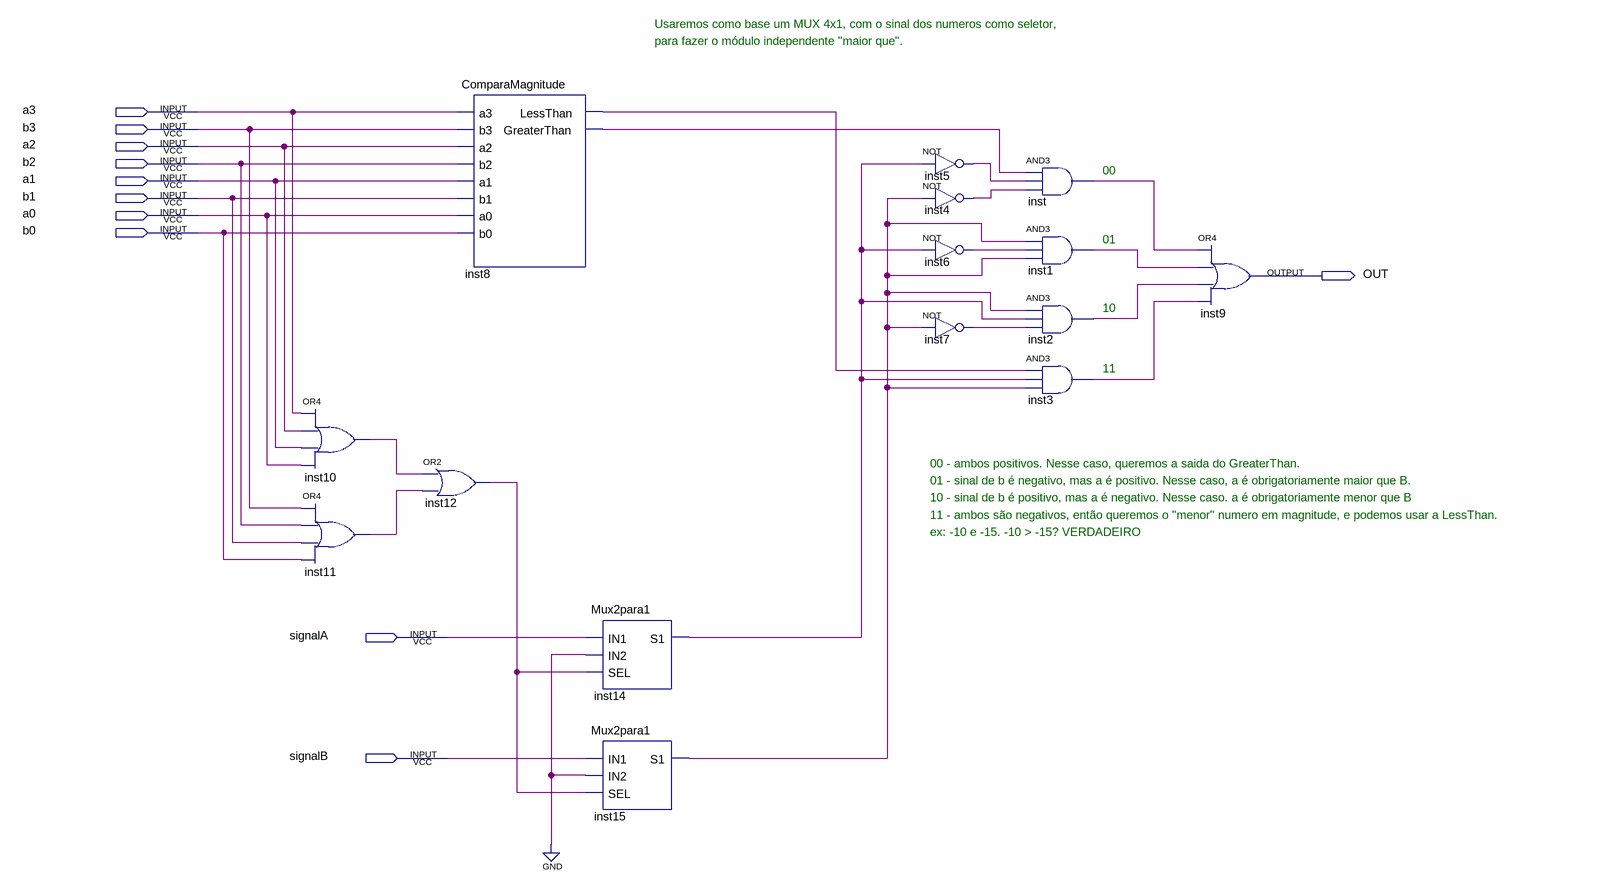
[diagram p0: schematic sheet]
// Quartus schematic MaiorQue.bdf as structural Verilog: 15 symbols, 11 pins
module MaiorQue (
  input  a3,
  input  b3,
  input  a2,
  input  b2,
  input  a1,
  input  b1,
  input  a0,
  input  b0,
  input  signalA,
  input  signalB,
  output OUT
);

  wire inst1_out, inst2_out, inst3_out, inst4_out, inst5_out, inst6_out, inst7_out, inst8_greaterthan,
       inst8_lessthan, inst10_out, inst11_out, inst12_out, inst14_s1, inst15_s1, inst_out;

  or inst10 (inst10_out, a3, a2, a1, a0);
  or inst11 (inst11_out, b3, b2, b1, b0);
  or inst12 (inst12_out, inst10_out, inst11_out);
  ComparaMagnitude inst8 (
    .a3(a3), .b3(b3), .a2(a2), .b2(b2), .a1(a1), .b1(b1), .a0(a0), .b0(b0), .LessThan(inst8_lessthan),
    .GreaterThan(inst8_greaterthan));
  Mux2para1 inst14 (.IN1(signalA), .IN2(1'b0), .SEL(inst12_out), .S1(inst14_s1));
  Mux2para1 inst15 (.IN1(signalB), .IN2(1'b0), .SEL(inst12_out), .S1(inst15_s1));
  not inst5 (inst5_out, inst14_s1);
  not inst4 (inst4_out, inst15_s1);
  not inst6 (inst6_out, inst14_s1);
  not inst7 (inst7_out, inst15_s1);
  and inst (inst_out, inst8_greaterthan, inst5_out, inst4_out);
  and inst1 (inst1_out, inst15_s1, inst6_out, inst15_s1);
  and inst2 (inst2_out, inst15_s1, inst14_s1, inst7_out);
  and inst3 (inst3_out, inst8_lessthan, inst14_s1, inst15_s1);
  or inst9 (OUT, inst_out, inst1_out, inst2_out, inst3_out);

  // Notes on the sheet:
  //   Usaremos como base um MUX 4x1, com o sinal dos numeros como seletor,
  //   para fazer o módulo independente "maior que".
  //   00
  //   01
  //   10
  //   11
  //   00 - ambos positivos. Nesse caso, queremos a saida do GreaterThan.
  //   01 - sinal de b é negativo, mas a é positivo. Nesse caso, a é obrigatoriamente maior que B.
  //   10 - sinal de b é positivo, mas a é negativo. Nesse caso. a é obrigatoriamente menor que B
  //   11 - ambos são negativos, então queremos o "menor" numero em magnitude, e podemos usar a LessThan.
  //   ex: -10 e -15. -10 > -15? VERDADEIRO
endmodule
